# Altium schematic sheet LED strips.SchDoc
size A4
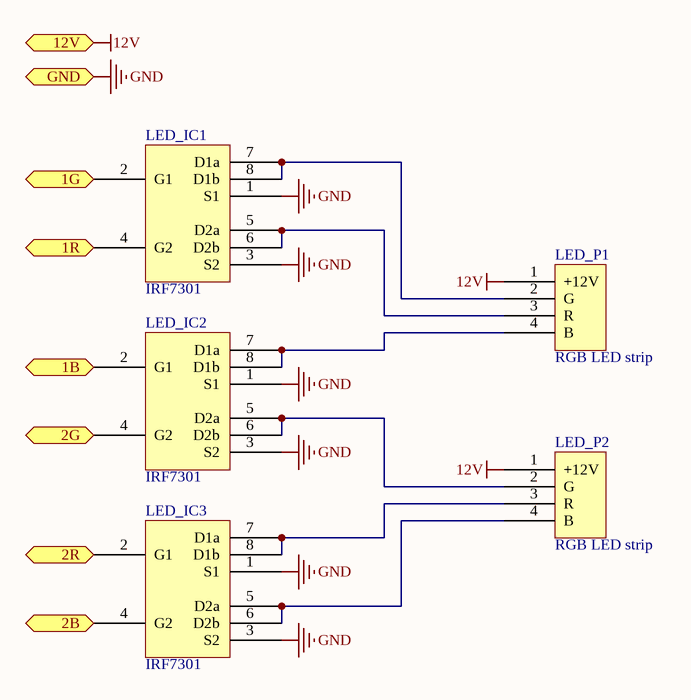
[diagram p0: LED strips.SchDoc]

## Parts
LED_IC1  IRF7301  [SOIC8]
LED_IC2  IRF7301  [SOIC8]
LED_IC3  IRF7301  [SOIC8]
LED_P1  RGB LED strip
LED_P2  RGB LED strip

## Ports
1B (in), 1G (in), 1R (in), 2B (in), 2G (in), 2R (in), 12V (in), GND (in)

## Nets
12V: LED_P1.1(+12V) LED_P2.1(+12V) ; port 12V
GND: LED_IC1.1(S1) LED_IC1.3(S2) LED_IC2.1(S1) LED_IC2.3(S2) LED_IC3.1(S1) LED_IC3.3(S2) ; port GND
1B: LED_IC2.2(G1) ; port 1B
1G: LED_IC1.2(G1) ; port 1G
1R: LED_IC1.4(G2) ; port 1R
2B: LED_IC3.4(G2) ; port 2B
2G: LED_IC2.4(G2) ; port 2G
2R: LED_IC3.2(G1) ; port 2R
NetLED_IC1_5: LED_IC1.5(D2a) LED_IC1.6(D2b) LED_P1.3(R)
NetLED_IC1_7: LED_IC1.7(D1a) LED_IC1.8(D1b) LED_P1.2(G)
NetLED_IC2_5: LED_IC2.5(D2a) LED_IC2.6(D2b) LED_P2.2(G)
NetLED_IC2_7: LED_IC2.7(D1a) LED_IC2.8(D1b) LED_P1.4(B)
NetLED_IC3_5: LED_IC3.5(D2a) LED_IC3.6(D2b) LED_P2.4(B)
NetLED_IC3_7: LED_IC3.7(D1a) LED_IC3.8(D1b) LED_P2.3(R)